# EAGLE design Hypnos V3.5 (EAGLE 9.6.2)
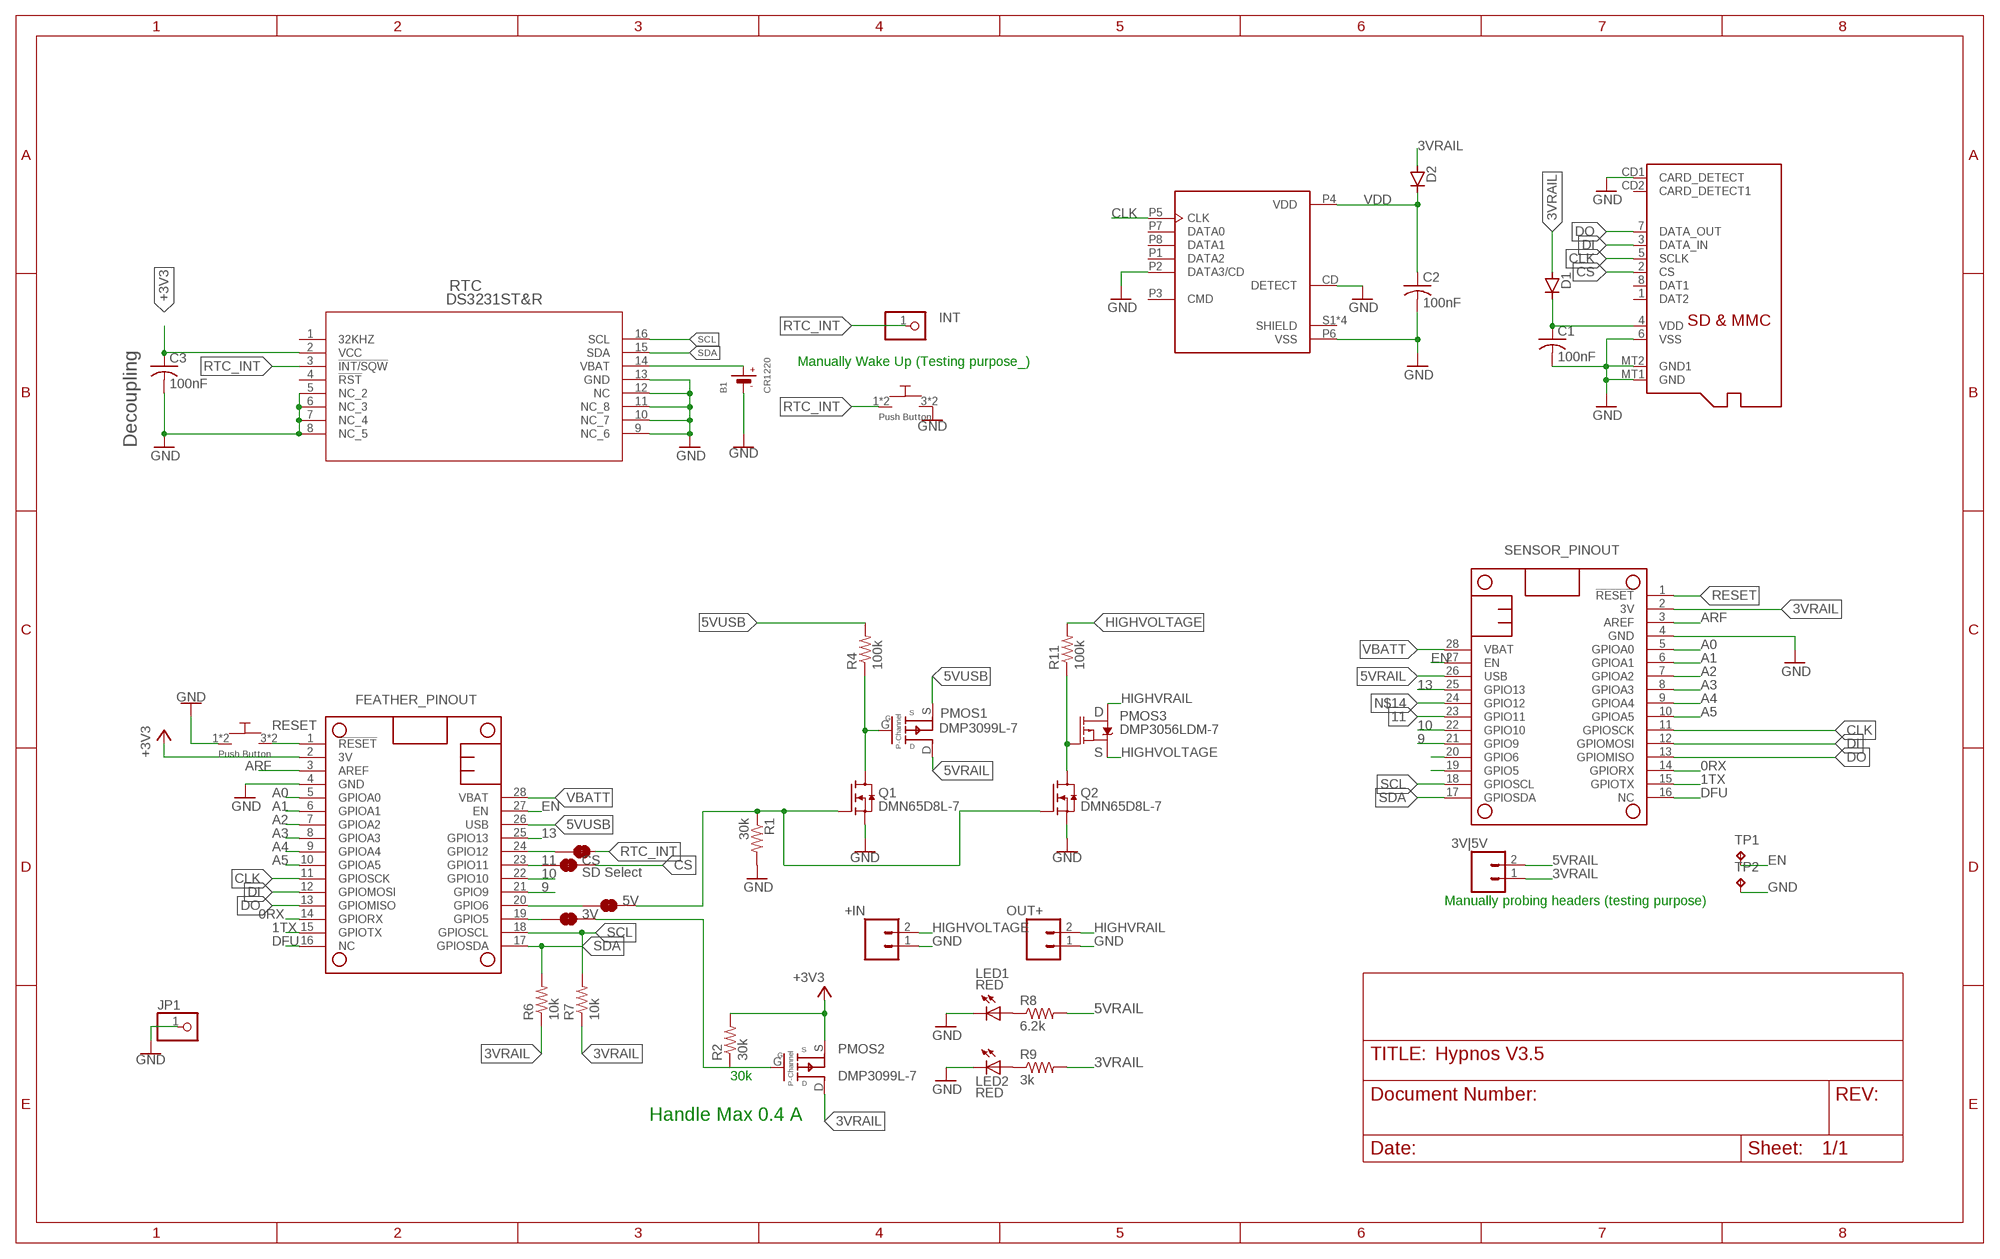
[diagram p0: schematic, sheet 1]

## Parts
3V  JUMPER-SMT_2_NC_TRACE_SILK  [SMT-JUMPER_2_NC_TRACE_SILK]
3V|5V  CONN_021X02_NO_SILK  [1X02_NO_SILK]
5V  JUMPER-SMT_2_NC_TRACE_SILK  [SMT-JUMPER_2_NC_TRACE_SILK]
+IN  HIGHV-IN  CONN_021X02_NO_SILK  [1X02_NO_SILK]
B1  CR1220  BATTERYCR1220_SMT  [CR1220]
C1  100nF  C-USC1206  [C1206]
C2  100nF  C-USC1206  [C1206]
C3  100nF  C-USC1206  [C1206]
CS  SD Select  JUMPER-SMT_2_NC_TRACE_SILK  [SMT-JUMPER_2_NC_TRACE_SILK]
D1  D-SOD123  [SOD123]
D2  D-SOD123  [SOD123]
FEATHERWING  SENSOR_PINOUT  FEATHERWING  [FEATHERWING]
INT  PINHD-1X1CB  [1X01-CLEANBIG]
J1  MEM2051-00-195-00-A_REVD1MEM2051-00-195-00-A_GCT_MEM2051-00-195-00-A  [GCT_MEM2051-00-195-00-A_REVD1]
JP1  PINHD-1X1CB  [1X01-CLEANBIG]
LED1  RED  LEDCHIPLED_0805  [CHIPLED_0805]
LED2  RED  LEDCHIPLED_0805  [CHIPLED_0805]
MICROSD  MICROSD  [MICROSD]
MS2  FEATHER_PINOUT  FEATHERWING  [FEATHERWING]
OUT+  HIGHV-OUT  CONN_021X02_NO_SILK  [1X02_NO_SILK]
PMOS1  DMP3099L-7  SSM3J3228R  [SOT-23-3]
PMOS2  DMP3099L-7  SSM3J3228R  [SOT-23-3]
PMOS3  DMP3056LDM-7  P-MOSFET  [SOT23-6]
Q1  DMN65D8L-7  NMOS  [SOT23-S]
Q2  DMN65D8L-7  NMOS  [SOT23-S]
R1  30k  WSLP1206R0500FEA  [RES_1206]
R2  30k  WSLP1206R0500FEA  [RES_1206]
R4  100k  WSLP1206R0500FEA  [RES_1206]
R6  10k  WSLP1206R0500FEA  [RES_1206]
R7  10k  WSLP1206R0500FEA  [RES_1206]
R8  6.2k  WSLP1206R0500FEA  [RES_1206]
R9  3k  WSLP1206R0500FEA  [RES_1206]
R11  100k  WSLP1206R0500FEA  [RES_1206]
RTC  DS3231ST&R  [21-0042B_16]
RTC_INT  JUMPER-SMT_2_NC_TRACE_SILK  [SMT-JUMPER_2_NC_TRACE_SILK]
TP1  TPTP16R  [TP16R]
TP2  TPTP16R  [TP16R]
U$1  PUSH_BUTTON  [PUSHBUTTON_SMD]
U$2  PUSH_BUTTON  [PUSHBUTTON_SMD]

## Nets
0RX: FEATHERWING.14(GPIORX) MS2.14(GPIORX)
1TX: FEATHERWING.15(GPIOTX) MS2.15(GPIOTX)
3VRAIL: 3V|5V.1 D1.2(A) D2.2(A) FEATHERWING.2(3V) PMOS2.D R6.1 R7.1 R9.2
5VRAIL: 3V|5V.2 FEATHERWING.26(USB) PMOS1.D R8.2
5VUSB: MS2.26(USB) PMOS1.S R4.2
9: FEATHERWING.21(GPIO9) MS2.21(GPIO9)
10: FEATHERWING.22(GPIO10) MS2.22(GPIO10)
11: CS.1 FEATHERWING.23(GPIO11) MS2.23(GPIO11)
13: FEATHERWING.25(GPIO13) MS2.25(GPIO13)
+3V3: C3.1 MS2.2(3V) PMOS2.S R2.2 RTC.2(VCC)
A0: FEATHERWING.5(GPIOA0) MS2.5(GPIOA0)
A1: FEATHERWING.6(GPIOA1) MS2.6(GPIOA1)
A2: FEATHERWING.7(GPIOA2) MS2.7(GPIOA2)
A3: FEATHERWING.8(GPIOA3) MS2.8(GPIOA3)
A4: FEATHERWING.9(GPIOA4) MS2.9(GPIOA4)
A5: FEATHERWING.10(GPIOA5) MS2.10(GPIOA5)
ARF: FEATHERWING.3(AREF) MS2.3(AREF)
CLK: FEATHERWING.11(GPIOSCK) J1.P5(CLK) MICROSD.5(SCLK) MS2.11(GPIOSCK)
CS: CS.2 MICROSD.2(CS)
DFU: FEATHERWING.16(NC) MS2.16(NC)
DI: FEATHERWING.12(GPIOMOSI) MICROSD.3(DATA_IN) MS2.12(GPIOMOSI)
DO: FEATHERWING.13(GPIOMISO) MICROSD.7(DATA_OUT) MS2.13(GPIOMISO)
EN: FEATHERWING.27(EN) MS2.27(EN) TP1.TP
GND [GND]: +IN.1 B1.- C1.2 C2.2 C3.2 FEATHERWING.4(GND) J1.CD(DETECT) J1.P2(DATA3/CD) J1.P6(VSS) JP1.1 LED1.C LED2.C MICROSD.6(VSS) MICROSD.CD1(CARD_DETECT) MICROSD.MT1(GND) MICROSD.MT2(GND1) MS2.4(GND) OUT+.1 Q1.2(S) Q2.2(S) R1.2 RTC.5(NC_2) RTC.6(NC_3) RTC.7(NC_4) RTC.8(NC_5) RTC.9(NC_6) RTC.10(NC_7) RTC.11(NC_8) RTC.12(NC) RTC.13(GND) TP2.TP U$1.1 U$1.2 U$2.3 U$2.4
HIGHVOLTAGE [HIGHVOLTAGE]: +IN.2 PMOS3.4(S) R11.2
HIGHVRAIL [HIGHVOLTAGE]: OUT+.2 PMOS3.1(D) PMOS3.2(D) PMOS3.5(D) PMOS3.6(D)
N$1: 5V.1 MS2.20(GPIO6)
N$2: B1.+$1(+) RTC.14(VBAT)
N$3: 3V.1 MS2.19(GPIO5)
N$4: 5V.2 Q1.1(G) Q2.1(G) R1.1
N$5: 3V.2 PMOS2.G R2.1
N$7: FEATHERWING.20(GPIO6)
N$8: FEATHERWING.19(GPIO5)
N$10: PMOS1.G Q1.3(D) R4.1
N$12: LED1.A R8.1
N$13: LED2.A R9.1
N$14: FEATHERWING.24(GPIO12) MS2.24(GPIO12) RTC_INT.1
N$15: PMOS3.3(G) Q2.3(D) R11.1
RESET: FEATHERWING.1(!RESET) MS2.1(!RESET) U$1.3 U$1.4
RTC_INT: INT.1 RTC.3(!INT/SQW) RTC_INT.2 U$2.1 U$2.2
SCL: FEATHERWING.18(GPIOSCL) MS2.18(GPIOSCL) R7.2 RTC.16(SCL)
SDA: FEATHERWING.17(GPIOSDA) MS2.17(GPIOSDA) R6.2 RTC.15(SDA)
VBATT: FEATHERWING.28(VBAT) MS2.28(VBAT)
VDD: C1.1 C2.1 D1.1(C) D2.1(C) J1.P4(VDD) MICROSD.4(VDD)
Unconnected: J1.P1(DATA2) J1.P3(CMD) J1.P7(DATA0) J1.P8(DATA1) J1.S1(SHIELD) J1.S2(SHIELD) J1.S3(SHIELD) J1.S4(SHIELD) MICROSD.1(DAT2) MICROSD.8(DAT1) MICROSD.CD2(CARD_DETECT1) RTC.1(32KHZ) RTC.4(!RST)

## Notes on the sheet
- Manually Wake Up (Testing purpose_)
- Decoupling
- D
- S
- Manually probing headers (testing purpose)
- 30k
- Handle Max 0.4 A

## Library data of the parts
3V 5V CS RTC_INT = SparkFun-Jumpers:JUMPER-SMT_2_NC_TRACE: Normally closed trace jumper This jumper has a trace between two pads so it's normally closed (NC). Use a razor knife to open the connection. For best results follow the IPC guidelines for cutting traces: Cutout at least 0.063 mm (0.005 in). Remove all loose material to clean up the cut area. Seal the cut with an approved epoxy. Reapply solder to reclose the connection.
3V|5V +IN OUT+ = SparkFun-Connectors:CONN_02: Multi connection point. Often used as Generic Header-pin footprint for 0.1 inch spaced/style header connections On any of the 0.1 inch spaced packages, you can populate with these: Break Away Headers - Straight <https://www.sparkfun.com/products/116> (PRT-00116) Break Away Male Headers - Right Angle <https://www.sparkfun.com/products/553> (PRT-00553) Female Headers <https://www.sparkfun.com/products/115> (PRT-00115) Break Away Headers - Machine Pin <https://www.sparkfun.com/products/117> (PRT-00117) Break Away Female Headers - Swiss Machine Pin <https://www.sparkfun.com/products/743> (PRT-00743) For SCREWTERMINALS and SPRING TERMINALS visit here: Screw Terimnals on SparkFun.com <https://www.sparkfun.com/search/results?term=Screw+Terminals> (5mm/3.5mm/2.54mm spacing) This device is also useful as a general connection point to wire up your design to another part of your project. Our various solder wires solder well into these plated through hole pads. Hook-Up Wire - Assortment (Stranded, 22 AWG) <https://www.sparkfun.com/products/11375> (PRT-11375) Hook-Up Wire - Assortment (Solid Core, 22 AWG) <https://www.sparkfun.com/products/11367> (PRT-11367) View the entire wire category on our website here <https://www.sparkfun.com/categories/141> Special notes: Molex polarized connector foot print use with: PRT-08233 with associated crimp pins and housings. 2.54_SCREWTERM for use with PRT-10571. 3.5mm Screw Terminal footprints for PRT-08084 5mm Screw Terminal footprints for use with PRT-08432
B1 = microbuilder:BATTERY: CR1220 SMT - Digikey: 3001K-ND CD2032 BAT-HLD-001 - Digikey: BAT-HLD-001-ND
C1-C3 = adafruit:C-US: CAPACITOR, American symbol
D1 D2 = semicon-smd-ipc:D-: DIODE unfilled
FEATHERWING = powerboard:FEATHERWING: Feather form factor pinout, 28 pins Forked from: https://github.com/adafruit/Adafruit-Eagle-Library
INT JP1 = adafruit:PINHD-1X1: Pin header 1x1 for 0.1" spacing With round pins
J1 = MEM2051-00-195-00-A_REVD1:MEM2051-00-195-00-A_REVD1; DESCRIPTION: 9 (8 + 1) Position Card Connector microSD Surface Mount, Right Angle Gold, 1.95mm profile, Normally open switch, Push push, Top mount; DIGI-KEY_PART_NUMBER: 2073-MEM2051-00-195-00-ATR-ND; MF: Global Connector Technology; MP: MEM2051-00-195-00-A; PACKAGE: None; PURCHASE-URL: https://pricing.snapeda.com/search/part/MEM2051-00-195-00-A/?ref=eda
LED1 LED2 = adafruit:LED: LED OSRAM: - CHIPLED LG R971, LG N971, LY N971, LG Q971, LY Q971, LO R971, LY R971 LH N974, LH R974 LS Q976, LO Q976, LY Q976 LO Q996 - Hyper CHIPLED LW Q18S LB Q993, LB Q99A, LB R99A - SideLED LS A670, LO A670, LY A670, LG A670, LP A670 LB A673, LV A673, LT A673, LW A673 LH A674 LY A675 LS A676, LA A676, LO A676, LY A676, LW A676 LS A679, LY A679, LG A679 - Hyper Micro SIDELED® LS Y876, LA Y876, LO Y876, LY Y876 LT Y87S - SmartLED LW L88C, LW L88S LB L89C, LB L89S, LG L890 LS L89K, LO L89K, LY L89K LS L896, LA L896, LO L896, LY L896 - TOPLED LS T670, LO T670, LY T670, LG T670, LP T670 LSG T670, LSP T670, LSY T670, LOP T670, LYG T670 LG T671, LOG T671, LSG T671 LB T673, LV T673, LT T673, LW T673 LH T674 LS T676, LA T676, LO T676, LY T676, LB T676, LH T676, LSB T676, LW T676 LB T67C, LV T67C, LT T67C, LS T67K, LO T67K, LY T67K, LW E67C LS E67B, LA E67B, LO E67B, LY E67B, LB E67C, LV E67C, LT E67C LW T67C LS T679, LY T679, LG T679 LS T770, LO T770, LY T770, LG T770, LP T770 LB T773, LV T773, LT T773, LW T773 LH T774 LS E675, LA E675, LY E675, LS T675 LS T776, LA T776, LO T776, LY T776, LB T776 LHGB T686 LT T68C, LB T68C - Hyper Mini TOPLED® LB M676 - Mini TOPLED Santana® LG M470 LS M47K, LO M47K, LY M47K Source: http://www.osram.convergy.de/
MICROSD = adafruit:MICROSD: Micro-SD / Transflash card holder with SPI pinout For the 3M # 2908-05WB-MG and/or 4UCON #19656 push-push type
MS2 = adafruit:FEATHERWING
PMOS1 PMOS2 = M0_Power:SSM3J3228R: PMOS 3.8A (Ta) 1.08W (Ta) Surface Mount SOT-23, 3 pins Source: https://www.digikey.com/en/products/detail/diodes-incorporated/DMP3099L-7/4471075?s=N4IgTCBcDaICIFkAKBmADATgwGQLQHY4BJAYQBVcA5OEAXQF8g Part #: DMP3099L-7DICT-ND; PMOS: P-MOSFET
PMOS3 = eDNA:P-MOSFET: P-Channel 30V 4.3A (Ta) 1.25W (Ta) Surface Mount SOT-26, 6 pins https://www.digikey.com/product-detail/en/diodes-incorporated/DMP3056LDM-7/DMP3056LDMDICT-ND/1964772 Part #: DMP3056LDMDICT-ND
Q1 Q2 = eDNA:NMOS: N-Channel 310mA (Ta) 370mW (Ta) Surface Mount SOT-23, 3 pins https://www.digikey.com/en/products/detail/diodes-incorporated/DMN65D8L-7/3677916 Part #: DMN65D8L-7DICT-ND
R1 R2 R4 R6-R9 R11 = Resistor_Capacitor:WSLP1206R0500FEA: RES 0.05 OHM 1% 1W 1206 Manufacturer's datasheet <http://www.vishay.com/docs/30122/wslp.pdf>; CREATED_BY: PCBLayout.com; DIGIKEY_PART_NUMBER: WSLP-.05TR-ND; MANUFACTURER: Vishay Dale; MPN: WSLP1206R0500FEA; PACKAGE: SMD 1206
RTC = power8:DS3231ST&R: DS3231 RTC IC only, 16 pins Source: https://www.digikey.com/en/products/detail/maxim-integrated/DS3231SN-T-R/1197577?s=N4IgTCBcDaICIGUDMYkEYEDkDEAVAZAEoDCuAtJnCALoC%2BQA Part #: DS3231SN#T&RCT-ND; MANUFACTURER_PART_NUMBER: DS3231S#T&R; VENDOR: Maxim Integrated Products
TP1 TP2 = testpad:TP: Test pad
U$1 U$2 = eDNA:PUSH_BUTTON: SMD low profile push-button NOPE https://www.mouser.com/ProductDetail/ALPS/SKTHAHE010?qs=sGAEpiMZZMsgGjVA3toVBFPD9IcV2kPoEtmOqlcDILk%3D https://www.digikey.com/product-detail/en/c-k/KMR731NG-LFS/CKN10687TR-ND/6035353 https://www.arrow.com/en/products/kmr731nglfs/ck https://www.mouser.com/ProductDetail/CK/KMR731NGLFS?qs=%2Fha2pyFaduiYmAh2YH01EjoHSsd%2F4x%252BsVgk0GVi4JwmLxfMBh2nzdw%3D%3D

## Net classes
2 HIGHVOLTAGE: clearance 0.3 mm
3 sig: width 0.152 mm, clearance 0.152 mm

## Board
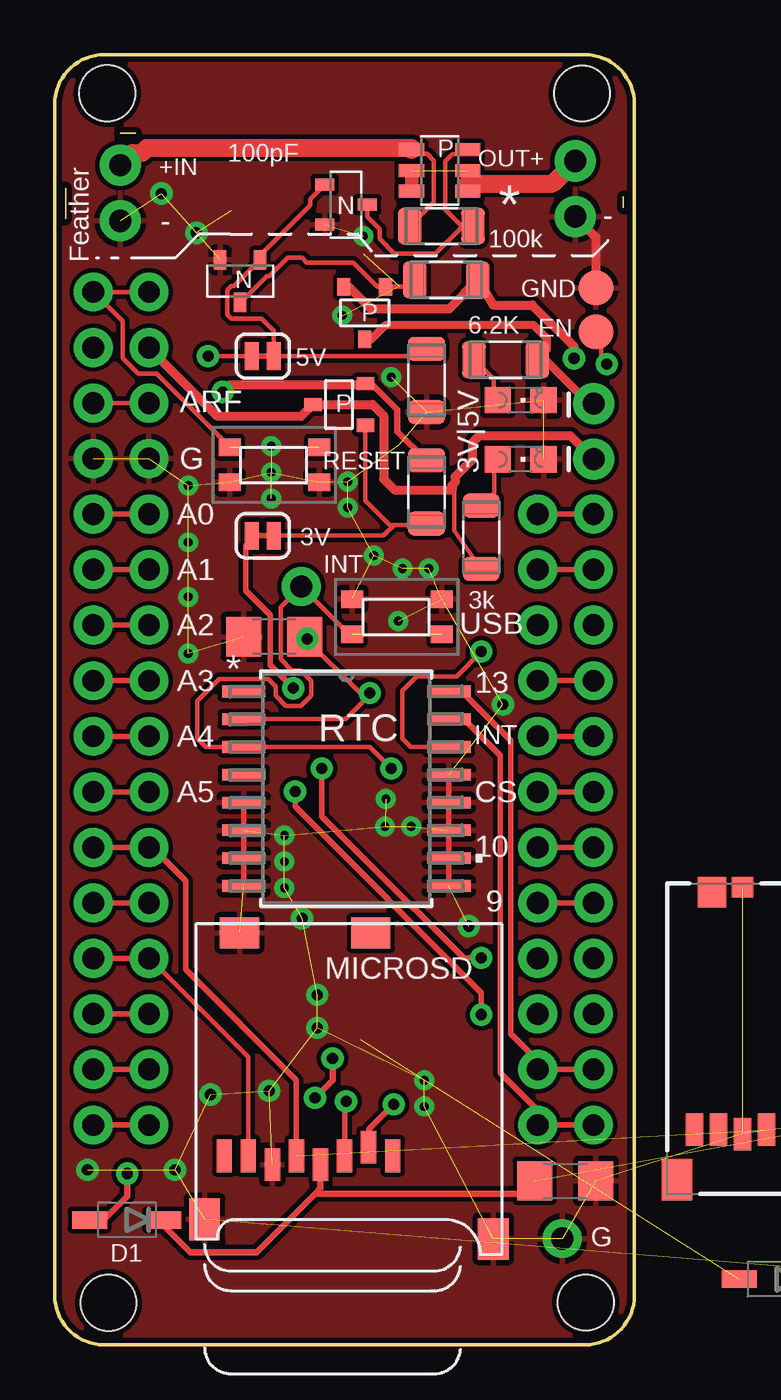
[diagram p1: board, top side]
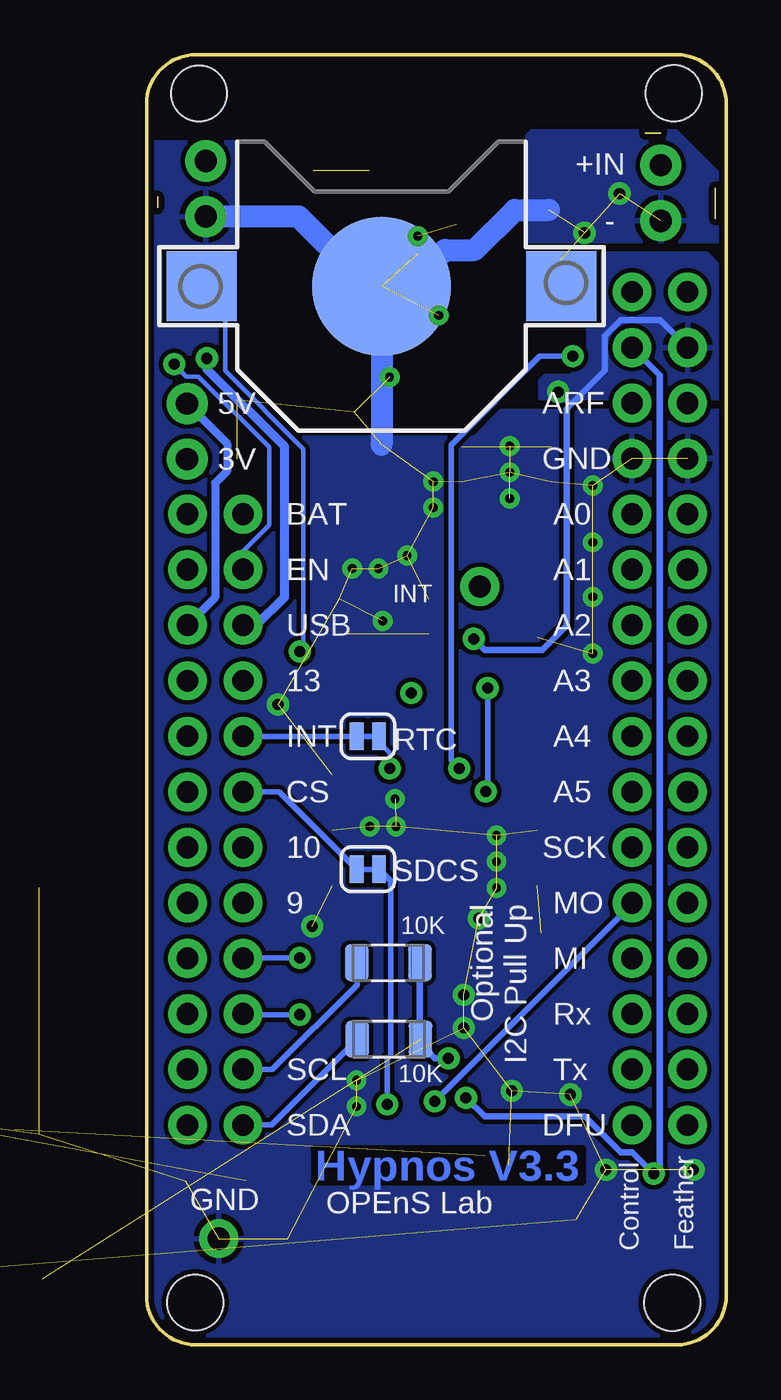
[diagram p2: board, bottom side, seen from below]

Size 26.5 x 59 mm. Coordinates in mm from the lower left corner, seen from the top.
Outline: 26,52.5 26,52
Outline: 0.5,51.5 0.5,52.9
Outline: 3,55.4 3.7,55.4
Outline: 0,2.25 0,56.75 arc-90 2.25,59 24.25,59 arc-90 26.5,56.75 26.5,2.25 arc-90 24.25,0 2.25,0 arc-90 0,2.25
Copper layers (1*16): Top 0.035mm / dielectric 1.5mm / Bottom 0.035mm
Design rules "SparkFun": minimum track width 8mil, minimum drill 20mil, track to track 8mil, track to pad 8mil, pad to pad 8mil, via to via 8mil, smd to smd 8mil, copper to edge 10mil, drill to drill 8mil, minimum pad ring 12mil, minimum via ring 10mil, stop-mask expansion 4mil, vias tented up to drill 25mil, thermal gap 10mil
Holes 2.54 mm at 24.27,1.94 2.4,57.23 24.1,57.23 2.46,1.93

### Footprints (pad centres in the part's own frame; a part is rotated, then mirrored left to right if it is on the bottom)
SMT-JUMPER_2_NC_TRACE_SILK = smd 0.635 x 1.27: 1 -0.508,0; 2 0.508,0
1X02_NO_SILK = drill 1.016 pad 1.88: 1 0,0; 2 2.54,0
CR1220 = smd 3.2 x 3.2: +$1 -8.225,0; +$2 8.225,0 | smd 6.35 x 6.35: - 0,0
C1206 = smd 1.6 x 1.8: 1 -1.4,0; 2 1.4,0
SOD123 = smd 1.6 x 0.8: 1 -1.7,0; 2 1.7,0
FEATHERWING = drill 1 pad 1.778: 1 6.35,1.27; 2 8.89,1.27; 3 11.43,1.27; 4 13.97,1.27; 5 16.51,1.27; 6 19.05,1.27; 7 21.59,1.27; 8 24.13,1.27; 9 26.67,1.27; 10 29.21,1.27; 11 31.75,1.27; 12 34.29,1.27; 13 36.83,1.27; 14 39.37,1.27; 15 41.91,1.27; 16 44.45,1.27; 17 44.45,21.59; 18 41.91,21.59; 19 39.37,21.59; 20 36.83,21.59; 21 34.29,21.59; 22 31.75,21.59; 23 29.21,21.59; 24 26.67,21.59; 25 24.13,21.59; 26 21.59,21.59; 27 19.05,21.59; 28 16.51,21.59
1X01-CLEANBIG = drill 1.016 pad 1.778: 1 0,0
GCT_MEM2051-00-195-00-A_REVD1 = smd 1 x 0.95: CD -3.56,7.425 | smd 0.8 x 1.5: P1 1.94,-3.66; P2 0.84,-3.26; P3 -0.26,-3.66; P4 -1.36,-3.86; P5 -2.46,-3.66; P6 -3.56,-3.86; P7 -4.66,-3.66; P8 -5.76,-3.66 | smd 1.3 x 1.4: S1 -4.95,7.2; S2 0.75,7.2 | smd 1.4 x 1.9: S3 6.6,-6.95; S4 -6.55,-5.95
CHIPLED_0805 = smd 1.2 x 1.2: A 0,-1.05; C 0,1.05
MICROSD = smd 0.7 x 1.5: 1 9,-10.64; 2 7.9,-10.24; 3 6.8,-10.64; 4 5.7,-11.04; 5 4.6,-10.64; 6 3.5,-11.04; 7 2.4,-10.64; 8 1.3,-10.64 | smd 1.8 x 1.4: CD1 2,-0.44; CD2 8,-0.44 | smd 1.4 x 1.9: MT1 0.4,-13.54; MT2 13.6,-14.44
SOT-23-3 = smd 0.8 x 0.6: D 1.2,0; G -1.2,0.95; S -1.2,-0.95
SOT23-6 = smd 1.146 x 0.597: 1 -1.287,0.95; 2 -1.287,0; 3 -1.287,-0.95; 4 1.287,-0.95; 5 1.287,0; 6 1.287,0.95
SOT23-S = smd 0.88 x 0.569: 1 -0.975,0.915; 2 -0.975,-0.915; 3 0.975,0
RES_1206 = smd 1.08 x 1.68: 1 -1.445,0; 2 1.445,0
21-0042B_16 = smd 1.981 x 0.533: 1 -4.686,4.445; 2 -4.686,3.175; 3 -4.686,1.905; 4 -4.686,0.635; 5 -4.686,-0.635; 6 -4.686,-1.905; 7 -4.686,-3.175; 8 -4.686,-4.445; 9 4.686,-4.445; 10 4.686,-3.175; 11 4.686,-1.905; 12 4.686,-0.635; 13 4.686,0.635; 14 4.686,1.905; 15 4.686,3.175; 16 4.686,4.445
TP16R = smd 1.6 x 1.6: TP 0,0
PUSHBUTTON_SMD = smd 1 x 0.8: 1 0,-1.6; 2 4.1,-1.6; 3 0,0; 4 4.1,0

### Placement (x,y rotation side)
3V  9.52,37 0 top
3V|5V  24.65,40.5 90 bottom
5V  9.52,45.22 0 top
+IN  3,51.4 90 top
B1  15.76,48.41 0 bottom
C1  23.34,7.5 0 top
C2  39,3 0 top  (outside the outline)
C3  10.04,32.38 180 top
CS  16.38,21.75 0 bottom
D1  3.29,5.71 180 top
D2  33,3 180 top  (outside the outline)
FEATHERWING  3.04,54.5 270 top
INT  11.27,34.68 0 top
J1  35,13.5 0 top
JP1  23.2,4.86 0 top
LED1  21.3,43.2 270 top
LED2  21.3,40.5 270 top
MICROSD  6.45,19.28 0 top
MS2  0.5,54.5 270 top
OUT+  23.8,51.6 90 top
PMOS1  14.17,47.19 270 top
PMOS2  13,43 180 top
PMOS3  17.6,53.7 180 top
Q1  8.48,48.65 270 top
Q2  13.31,52.14 0 top
R1  17,44.1 270 top
R2  17,39 90 top
R4  17.9,48.7 0 top
R6  15.42,13.98 180 bottom
R7  15.45,17.47 180 bottom
R8  20.61,45.05 0 top
R9  19.5,36.93 270 top
R11  17.68,51.16 180 top
RTC  13.33,25.43 0 top
RTC_INT  16.38,27.83 0 bottom
TP1  24.74,46.33 0 top
TP2  24.74,48.33 0 top
U$1  8,41.05 0 top
U$2  13.6,34.1 0 top

### Tracks (layer width: path | path; a pad name or v marks a point on that pad's centre or on a via)
0RX
  Top 0.254: MS2.14 FEATHERWING.14
1TX
  Top 0.254: MS2.15 FEATHERWING.15
3VRAIL  (via drill 0.51)  (1 unrouted)
  Top 0.203: R9.2 18.28,37.23 18.28,38.99 18.17,39.1
  Top 0.305: v3.32,7.83 3.32,6.79 2.23,5.71 D1.2 | v11.9,11.3 12.7,12.1 v12.7,13.1
  Top 0.406: 3V|5V.1 23.57,41.58 19.41,41.58 19.11,41.28 19.11,40.5 18.31,39.7 18.31,39.45 18.17,39.32 18.17,39.1 15.55,39.1 15.04,39.6 15.04,42.5 14.54,43 PMOS2.D 11.26,42.46 7.46,42.46 FEATHERWING.2
  Bottom 0.305: FEATHERWING.2 3.04,44.34 3.04,8.11 v3.32,7.83 4.29,8.8 4.83,8.8 6.47,10.45 11.05,10.45 v11.9,11.3 | v12.7,13.1 13.32,13.1 13.97,13.75 R6.1 14.01,14.01 R7.1
5VRAIL
  Top 0.305: 22.5,45.52 R8.2 | PMOS1.D 14.48,45.99
  Top 0.355: 22.5,45.52 22.5,46.03 21.88,46.65 15.14,46.65 14.48,45.99 | 3V|5V.2 24.44,43.04 22.43,45.05 R8.2
  Bottom 0.355: 3V|5V.2 22.81,41.2 22.81,39.96 23.36,39.41 23.36,34.18 FEATHERWING.26
5VUSB  (via drill 0.51)
  Top 0.406: v23.74,45.11 23.74,45.65 21.83,47.56 20.04,47.56 R4.2 18.03,47.38 14.45,47.38 13.45,48.39 PMOS1.S
  Bottom 0.305: 23.74,44.62 v23.74,45.11
  Bottom 0.406: MS2.26 21.48,32.91 20.19,34.2 20.19,41.07 23.74,44.62
9
  Top 0.254: FEATHERWING.21 MS2.21
10
  Top 0.254: FEATHERWING.22 MS2.22
11
  Top 0.254: MS2.23 FEATHERWING.23
  Bottom 0.254: CS.1 20.43,25.29 MS2.23
13
  Top 0.254: MS2.25 FEATHERWING.25
+3V3  (via drill 0.51)
  Top 0.203: C3.1 11.44,32.33 13.96,29.81 v14.4,29.81 14.4,29.71 13.3,28.61 RTC.2
  Top 0.305: 14.15,43.9 PMOS2.S 14.47,43.95 15.66,42.76 15.66,41.76 R2.2 | v11.54,32.28 C3.1
  Top 0.406: 14.15,43.9 8.01,43.9 v7.69,43.58
  Bottom 0.305: 7.11,42.99 v7.69,43.58 | 7.11,42.99 5.55,44.55 5.55,46.13 4.83,46.85 3.02,46.85 MS2.2 | 7.11,42.99 7.3,42.8 7.3,32.9 8.41,31.79 11.04,31.79 v11.54,32.28
  pour Bottom: 0.2,43.3 0.2,49.2 0.9,49.9 6.3,49.9 6.3,45.1 7.1,44.3 8.3,44.3 8.5,44.1 8.5,43.3
A0
  Top 0.254: MS2.5 FEATHERWING.5
A1
  Top 0.254: MS2.6 FEATHERWING.6
A2
  Top 0.254: MS2.7 FEATHERWING.7
A3
  Top 0.254: MS2.8 FEATHERWING.8
A4
  Top 0.254: MS2.9 FEATHERWING.9
A5
  Top 0.254: MS2.10 FEATHERWING.10
ARF
  Top 0.203: MS2.3 FEATHERWING.3
CLK  (1 unrouted)
  Top 0.254: MICROSD.5 11.05,12.1 5.99,17.16 5.99,21.21 4.45,22.75 FEATHERWING.11 MS2.11
CS  (via drill 0.51)
  Top 0.254: v15.5,11 14.35,9.85 MICROSD.2
  Bottom 0.254: v15.5,11 15.5,13.08 15.33,13.25 15.33,21.21 CS.2
DFU
  Top 0.254: MS2.16 FEATHERWING.16
DI  (via drill 0.51)
  Top 0.254: v13.32,11.14 13.25,11.07 MICROSD.3 | MS2.12 FEATHERWING.12
  Bottom 0.254: v13.32,11.14 4.31,20.15 FEATHERWING.12
DO
  Top 0.203: FEATHERWING.13 4.35,17.67 | MICROSD.7 8.85,13.17 4.51,17.51
  Top 0.254: MS2.13 4.35,17.67 4.51,17.51
EN  (via drill 0.51)
  Top 0.203: v25.24,44.84 24.98,45.1 24.98,45.84 24.7,46.12 24.7,46.33 TP1.TP
  Top 0.254: MS2.27 FEATHERWING.27
  Bottom 0.203: v25.24,44.84 24.68,44.28 24.13,44.28 20.9,41.05 20.9,37.5 22.09,36.3 MS2.27
GND  (via drill 0.4, 0.51)  (60 unrouted)
  Top 0.254: RTC.8 RTC.7 RTC.6 RTC.5 | RTC.9 RTC.10 RTC.11 RTC.12 RTC.13
  Top 0.406: OUT+.1 24.74,50.66 TP2.TP
  Bottom 0.406: v14.1,50.7 14.1,49.9
  Bottom 0.813: 14.51,49.66 B1.- 16.36,48.41
  Bottom 1.016: B1.- 15.76,41.16 | 14.51,49.66 13.66,49.66 13.46,49.46 12.86,50.06 11.52,50.06 9.68,51.9 8.1,51.9 | 16.36,48.41 19.55,51.6 OUT+.1
  other vias: 9.8,11.61 15.14,24.96 14.59,36.1 11.31,19.5 4.88,52.65 20.49,29.28 7.12,11.45 12,16 5.5,8 1.5,8 12,14.5 13.4,39.47 13.4,38.29 13.14,47.08 9.9,41.1 9.9,39.9 9.9,38.7 15.1,23.7 16.3,23.7 15.9,35.5 17.1,35.5 15.7,33.1 10.5,23.3 10.5,22.1 10.5,20.9 16.9,12.1 16.9,10.9 15.39,44.26 6.48,50.85 6.1,36.7 6.1,39.3 6.1,34.2 6.1,31.61 18.93,19.14
  pour Top: 0,59 26.5,59 26.5,0 0,0
  pour Bottom: -0.1,42.7 10.3,42.7 11.5,41.5 19.5,41.5 22.5,44.5 22.5,55 26.5,55 26.5,0 -0.1,0
  pour Bottom: 0,50.46 0,53.2 2.3,55.5 8.9,55.5 9.1,55.3 9.1,50.5 9.06,50.46
HIGHVOLTAGE
  Top 0.203: PMOS3.4 16.5,54.46 17.02,54.46 17.32,54.16 17.32,52.26 16.27,51.2 R11.2
  Top 0.813: +IN.2 3.56,54.5 3.99,54.5 4.23,54.74 16.31,54.74 PMOS3.4
HIGHVRAIL  (1 unrouted)
  Top 0.61: PMOS3.1 18.89,53.1 PMOS3.2 18.93,53.65 | PMOS3.5 PMOS3.6
  Top 0.813: OUT+.2 22.76,53.1 18.89,53.1
N$1  (via drill 0.51)
  Top 0.203: 8.95,45.16 5V.1 v7.01,45.21
  Top 0.254: v19.5,17.7 18.7,17.7 16.49,19.91 16.45,19.91 12.21,24.15 v12.21,26.36
  Bottom 0.254: v7.01,45.21 8.52,45.21 12.58,41.15 12.58,26.73 v12.21,26.36 | v19.5,17.7 22.06,17.7 MS2.20
N$2  (via drill 0.51)
  Top 0.203: RTC.14 16.28,27.34 15.88,27.74 15.88,29.89 16.56,30.57 18.37,30.57 v19.5,31.7
  Bottom 0.203: v19.5,31.7 19.33,31.87 19.33,40.97 22.91,44.55 22.91,47.33 B1.+$1
N$3  (via drill 0.51)
  Top 0.254: v10.91,30.03 9.86,31.08 9.86,33.37 8.74,34.49 8.74,36.53 9.01,36.8 3V.1 | v19.5,15.1 19.5,16.1 10.99,24.61 v10.99,25.3
  Bottom 0.254: v10.91,30.03 10.91,25.38 v10.99,25.3 | v19.5,15.1 22.06,15.1 MS2.19
N$4
  Top 0.203: R1.1 17,45.51 16.7,45.22 5V.2 10.02,46.38 9.47,46.93 8.07,46.93 7.89,47.1 7.89,48.24 8.07,48.41 8.19,48.41 Q1.1 9.39,49.84 11.68,52.12 11.68,52.39 Q2.1
N$5
  Top 0.203: 15.52,37.5 15.31,37.5 14.2,38.61 PMOS2.G | 15.52,37.5 16.92,37.5 R2.1 | 15.52,37.5 15.02,37 3V.2
N$10
  Top 0.203: R4.1 16.59,48.39 PMOS1.G 14.75,48.39 13.65,49.49 11.53,49.49 11.31,49.71 10.64,49.71 9.81,48.88 9.68,48.88 Q1.3
N$12
  Top 0.203: LED1.A 20.07,43.38 20.07,44.16 R8.1
N$13
  Top 0.203: R9.1 20.1,38.95 20.1,40.35 LED2.A
N$14
  Top 0.254: MS2.24 FEATHERWING.24
  Bottom 0.254: MS2.24 RTC_INT.1
N$15
  Top 0.203: PMOS3.3 18.68,54.45 18.18,54.45 17.86,54.12 17.86,51.91 18.61,51.16 R11.1 18.65,51.16 17.4,49.91 15.53,49.91 14.86,50.58 14.86,51.01 14.29,51.58 Q2.3
RESET  (1 unrouted)
  Top 0.203: FEATHERWING.1 MS2.1 3.06,46.86 3.12,46.8 3.12,45.12 3.82,44.42 4.66,44.42 8,41.08 U$1.3
RTC_INT  (via drill 0.51)  (1 unrouted)
  Top 0.203: v15.38,26.36 14.4,27.34 RTC.3 6.91,27.34 6.51,27.74 6.51,29.43 7.53,30.45 9.76,30.45 10.1,30.12 10.1,29.69 10.57,29.22 11.25,29.22 11.72,29.69 11.72,30.37 11.25,30.84 10.85,30.84 10.34,31.35 10.34,33.75 INT.1 12.37,33.59 13.45,32.5 U$2.1 | 17.73,32.48 U$2.2
  Bottom 0.203: RTC_INT.2 15.87,27.55 15.38,27.06 v15.38,26.36
SCL
  Top 0.203: 18.67,29.82 18.08,29.82 RTC.16
  Top 0.254: 18.67,29.82 20.86,27.63 20.86,14.22 22.09,12.99 MS2.18 FEATHERWING.18
  Bottom 0.254: R7.2 16.87,16.47 20.75,12.59 MS2.18
SDA
  Top 0.203: RTC.15 18.71,28.61
  Top 0.254: 18.71,28.61 20.37,26.95 20.37,12.45 22.09,10.73 MS2.17 FEATHERWING.17
  Bottom 0.254: R6.2 20.77,10.05 MS2.17
VBATT
  Top 0.254: MS2.28 FEATHERWING.28
VDD  (3 unrouted)
  Top 0.305: D1.1 5,5.44 6.2,4.23 9.23,4.23 11.9,6.9 | MICROSD.4 12.15,7.15 11.9,6.9 | C1.1 21.34,6.9 11.9,6.9

### Text on the board
Bottom: Hypnos V3.3
tPlace: 100pF | P | N | - | - | 100k | Feather | N | GND | P | 6.2K | EN | ARF | P | G | RESET | A0 | A1 | 3k | A2 | A3 | A4 | A5 | G
bPlace: +IN | - | ARF | 5V | GND | 3V | A0 | BAT | A1 | EN | INT | A2 | USB | A3 | 13 | RTC | A4 | INT | A5 | CS | SCK | SDCS | 10 | Optional / I2C Pull Up | MO | 9 | 10K | MI | Rx | Tx | 10K | SCL | DFU | SDA | OPEnS Lab | GND | Feather | Control
tNames: USB | 13 | INT | CS | 10 | 9
bStop: Hypnos V3.7